# Altium schematic sheet 2_Rotary_Encoder_IC.SchDoc
size A4; SheetNumber: 3; SheetTotal: 4
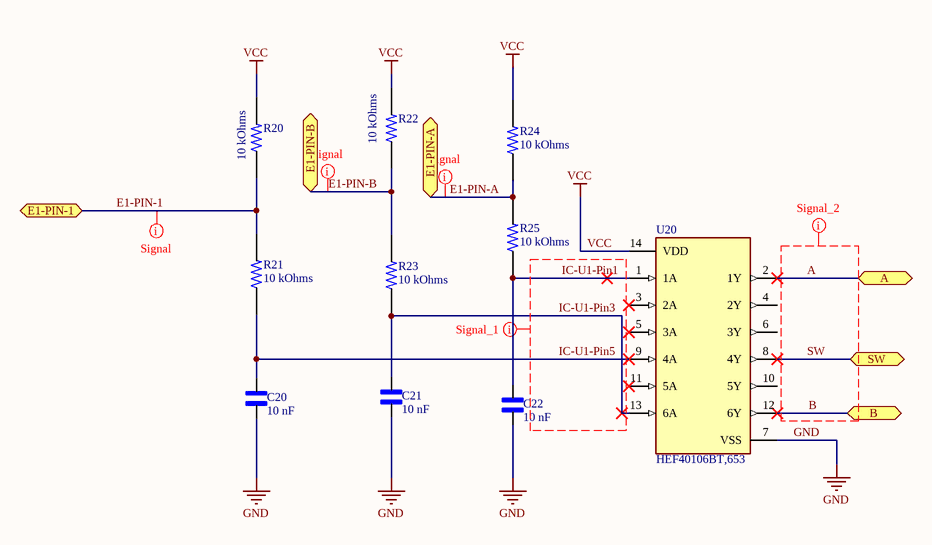
[diagram p0: 2_Rotary_Encoder_IC.SchDoc]

## Parts
C20  10 nF  [C-0603]
C21  10 nF  [C-0603]
C22  10 nF  [C-0603]
R20  10 kOhms  [R-0603]
R21  10 kOhms  [R-0603]
R22  10 kOhms  [R-0603]
R23  10 kOhms  [R-0603]
R24  10 kOhms  [R-0603]
R25  10 kOhms  [R-0603]
U20  HEF40106BT,653  [FP-SOT108-1-IPC_A]

## Ports
A (bidir), B (bidir), E1-PIN-1 (bidir), E1-PIN-A (bidir), E1-PIN-B (bidir), SW (bidir)

## Nets
GND: C20.1 C21.1 C22.1 U20.7(VSS)
VCC: R20.2 R22.2 R24.2 U20.14(VDD)
A: U20.2(1Y) ; port A
B: U20.12(6Y) ; port B
E1-PIN-1: R20.1 R21.2 ; port E1-PIN-1
E1-PIN-A: R24.1 R25.2 ; port E1-PIN-A
E1-PIN-B: R22.1 R23.2 ; port E1-PIN-B
IC-U1-Pin1: C22.2 R25.1 U20.1(1A)
IC-U1-Pin3: C21.2 R23.1 U20.13(6A)
IC-U1-Pin5: C20.2 R21.1 U20.9(4A)
SW: U20.8(4Y) ; port SW

Not connected (* = marked no-connect by the designer): U20 3(2A)* 4(2Y) 5(3A)* 6(3Y) 10(5Y) 11(5A)*

## Layout directives
net class Signal: A, B, E1-PIN-1, E1-PIN-A, E1-PIN-B, IC-U1-Pin1, IC-U1-Pin3, IC-U1-Pin5, SW

## Library data of the parts
C20-C22 = C-0603: Ceramic Capacitor 16V 0603 (1608 Metric); MP: C0603C104J4RAC; MF: KEMET; SnapEDA_Link: https://www.snapeda.com/parts/C0603C104J4RAC/KEMET/view-part/1763758/?ref=snap; Availability: Warning; Package: 0603 KEMET; Check_prices: https://www.snapeda.com/parts/C0603C104J4RAC/KEMET/view-part/1763758/?ref=eda; Value: *; Price: None
R20 R22 R24 = R-0603: 0603; MP: 2-1623703-0; Power_Rating: .1 W; Value: 10K; Tolerance: 1%; MF: TE Connectivity; XjtagCategorisation: pull-resistor.pdd; Package: 0603; Price: None; Resistance: 10K; Check_prices: https://www.snapeda.com/parts/2-1623703-0/TE%20Connectivity/view-part/2213192/?ref=eda; SnapEDA_Link: https://www.snapeda.com/parts/2-1623703-0/TE%20Connectivity/view-part/2213192/?ref=snap; Availability: Warning
R21 R23 R25 = R-0603: 0603; MP: 2-1623703-0; Power_Rating: .1 W; Value: 10K; Tolerance: 1%; MF: TE Connectivity; XjtagCategorisation: resistor.pdd; Package: 0603; Price: None; Resistance: 10K; Check_prices: https://www.snapeda.com/parts/2-1623703-0/TE%20Connectivity/view-part/2213192/?ref=eda; SnapEDA_Link: https://www.snapeda.com/parts/2-1623703-0/TE%20Connectivity/view-part/2213192/?ref=snap; Availability: Warning
U20 = CD4016B: IC INVERT SCHMITT 6CH 6-INP 14SO; RoHS Compliant: Yes